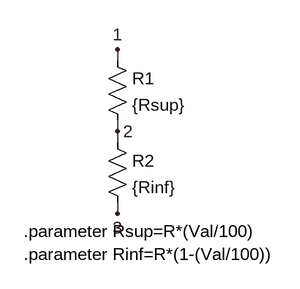
[diagram p0: schematic MyPot.asc]
MyPot.asc, the LTspice schematic file:
Version 4
SHEET 1 880 680
WIRE 208 48 208 32
WIRE 208 144 208 128
WIRE 208 160 208 144
WIRE 208 256 208 240
FLAG 208 32 1
FLAG 208 144 2
FLAG 208 256 3
SYMBOL res 192 32 R0
SYMATTR InstName R1
SYMATTR Value {Rsup}
SYMBOL res 192 144 R0
SYMATTR InstName R2
SYMATTR Value {Rinf}
TEXT 80 280 Left 2 !.parameter Rsup=R*(Val/100)\n.parameter Rinf=R*(1-(Val/100))

The netlist it stands for:
* MyPot.asc
R1 1 2 {Rsup}
R2 2 3 {Rinf}
.parameter Rsup=R*(Val/100)
.parameter Rinf=R*(1-(Val/100))
.backanno
.end